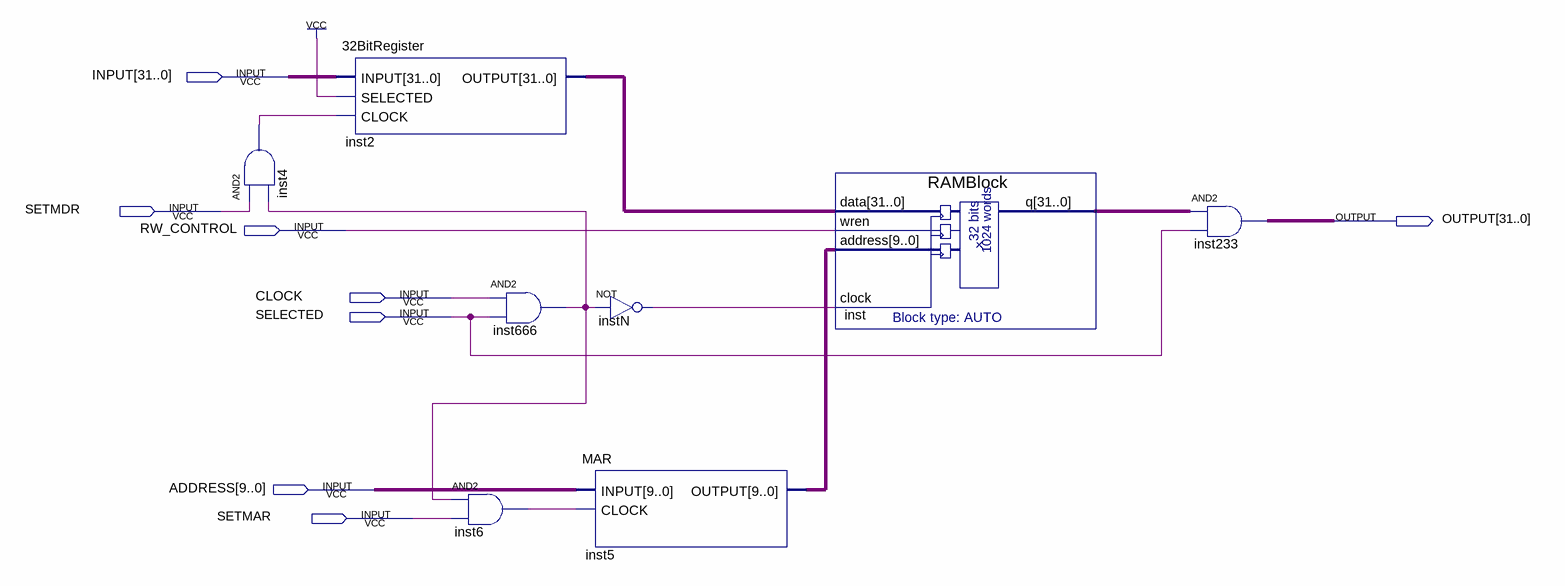
[diagram p0: schematic sheet]
// Quartus schematic RAMLogic.bdf as structural Verilog: 8 symbols, 8 pins
module RAMLogic (
  input  [31:0] INPUT,
  input  SETMDR,
  input  RW_CONTROL,
  input  CLOCK,
  input  SELECTED,
  input  [9:0] ADDRESS,
  input  SETMAR,
  output [31:0] OUTPUT
);

  wire inst4_out, inst6_out, inst666_out, instN_out;
  wire [9:0] inst5_output;
  wire [31:0] inst2_output, inst_q;

  and inst4 (inst4_out, SETMDR, inst666_out);
  \32BitRegister  inst2 (.INPUT(INPUT), .SELECTED(1'b1), .CLOCK(inst4_out), .OUTPUT(inst2_output));
  and inst6 (inst6_out, inst666_out, SETMAR);
  and inst666 (inst666_out, CLOCK, SELECTED);
  not instN (instN_out, inst666_out);
  MAR inst5 (.INPUT(ADDRESS), .CLOCK(inst6_out), .OUTPUT(inst5_output));
  RAMBlock inst (.data(inst2_output), .wren(RW_CONTROL), .address(inst5_output), .clock(instN_out), .q(inst_q));
  assign OUTPUT = inst_q & {32{SELECTED}};  // AND2 inst233, 32 bits wide
endmodule
